# EAGLE design mequencer (EAGLE 6.5.0)
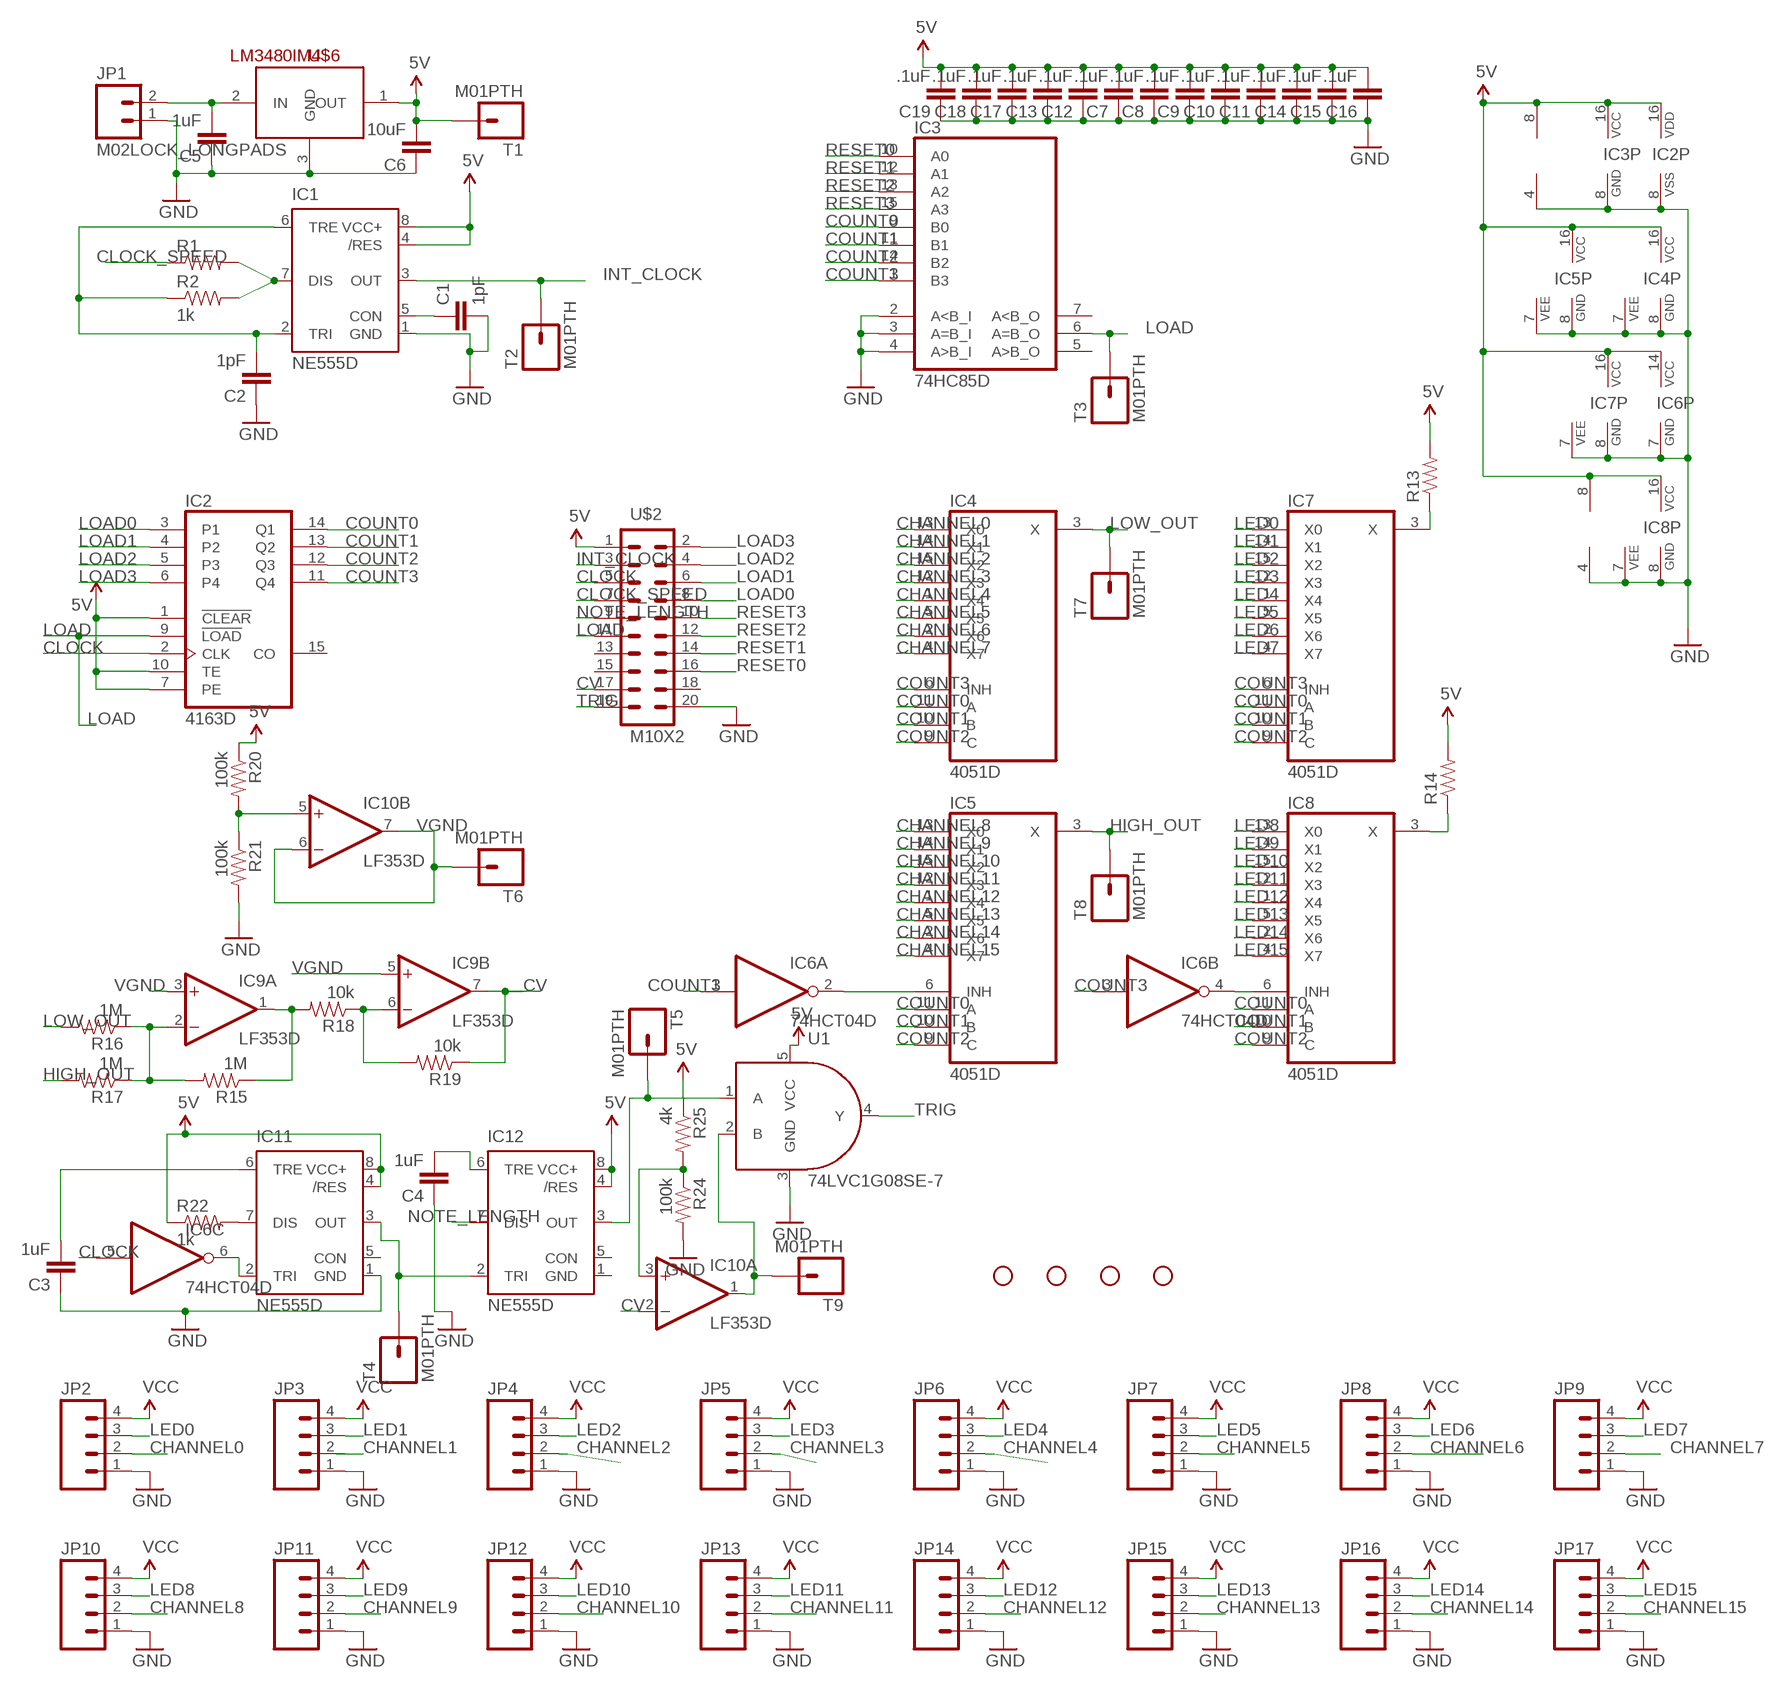
[diagram p0: schematic, sheet 1]

## Parts
C1  1pF  CAP0603-CAP  [0603-CAP]
C2  1pF  CAP0603-CAP  [0603-CAP]
C3  1uF  CAP0603-CAP  [0603-CAP]
C4  1uF  CAP0603-CAP  [0603-CAP]
C5  1uF  CAP0603-CAP  [0603-CAP]
C6  10uF  CAP0603-CAP  [0603-CAP]
C7  .1uF  CAP0603-CAP  [0603-CAP]
C8  .1uF  CAP0603-CAP  [0603-CAP]
C9  .1uF  CAP0603-CAP  [0603-CAP]
C10  .1uF  CAP0603-CAP  [0603-CAP]
C11  .1uF  CAP0603-CAP  [0603-CAP]
C12  .1uF  CAP0603-CAP  [0603-CAP]
C13  .1uF  CAP0603-CAP  [0603-CAP]
C14  .1uF  CAP0603-CAP  [0603-CAP]
C15  .1uF  CAP0603-CAP  [0603-CAP]
C16  .1uF  CAP0603-CAP  [0603-CAP]
C17  .1uF  CAP0603-CAP  [0603-CAP]
C18  .1uF  CAP0603-CAP  [0603-CAP]
C19  .1uF  CAP0603-CAP  [0603-CAP]
IC1  NE555D  [SO08]
IC2  4163D  [SO16]
IC3  74HC85D  [SO16]
IC4  4051D  [SO16]
IC5  4051D  [SO16]
IC6  74HCT04D  [SO14]
IC7  4051D  [SO16]
IC8  4051D  [SO16]
IC9  LF353D  [SO08]
IC10  LF353D  [SO08]
IC11  NE555D  [SO08]
IC12  NE555D  [SO08]
JP1  M02LOCK_LONGPADS  [1X02_LOCK_LONGPADS]
JP2  M04JST-PTH  [JST-4-PTH]
JP3  M04JST-PTH  [JST-4-PTH]
JP4  M04JST-PTH  [JST-4-PTH]
JP5  M04JST-PTH  [JST-4-PTH]
JP6  M04JST-PTH  [JST-4-PTH]
JP7  M04JST-PTH  [JST-4-PTH]
JP8  M04JST-PTH  [JST-4-PTH]
JP9  M04JST-PTH  [JST-4-PTH]
JP10  M04JST-PTH  [JST-4-PTH]
JP11  M04JST-PTH  [JST-4-PTH]
JP12  M04JST-PTH  [JST-4-PTH]
JP13  M04JST-PTH  [JST-4-PTH]
JP14  M04JST-PTH  [JST-4-PTH]
JP15  M04JST-PTH  [JST-4-PTH]
JP16  M04JST-PTH  [JST-4-PTH]
JP17  M04JST-PTH  [JST-4-PTH]
R1  RESISTOR0603  [0603-RES]
R2  1k  RESISTOR0603  [0603-RES]
R13  RESISTOR0603  [0603-RES]
R14  RESISTOR0603  [0603-RES]
R15  1M  RESISTOR0603  [0603-RES]
R16  1M  RESISTOR0603  [0603-RES]
R17  1M  RESISTOR0603  [0603-RES]
R18  10k  RESISTOR0603  [0603-RES]
R19  10k  RESISTOR0603  [0603-RES]
R20  100k  RESISTOR0603  [0603-RES]
R21  100k  RESISTOR0603  [0603-RES]
R22  1k  RESISTOR0603  [0603-RES]
R24  100k  RESISTOR0603  [0603-RES]
R25  4k  RESISTOR0603  [0603-RES]
STANDOFF1  STAND-OFF  [STAND-OFF]
STANDOFF2  STAND-OFF  [STAND-OFF]
STANDOFF3  STAND-OFF  [STAND-OFF]
STANDOFF4  STAND-OFF  [STAND-OFF]
T1  M01PTH  [1X01]
T2  M01PTH  [1X01]
T3  M01PTH  [1X01]
T4  M01PTH  [1X01]
T5  M01PTH  [1X01]
T6  M01PTH  [1X01]
T7  M01PTH  [1X01]
T8  M01PTH  [1X01]
T9  M01PTH  [1X01]
U1  74LVC1G08SE-7  7408SE  [SOT353]
U$2  M10X2  [2X10]
U$6  LM3480IM4  [SOT23-3]

## Nets
5V: C6.2 C7.2 C8.2 C9.2 C10.2 C11.2 C12.2 C13.2 C14.2 C15.2 C16.2 C17.2 C18.2 C19.2 IC1.4(/RES) IC1.8(VCC+) IC2.1(!CLEAR) IC2.7(PE) IC2.10(TE) IC2.16(VDD) IC3.16(VCC) IC4.16(VCC) IC5.16(VCC) IC6.14(P:VCC) IC7.16(VCC) IC8.16(VCC) IC9.8(P:V+) IC10.8(P:V+) IC11.4(/RES) IC11.8(VCC+) IC12.4(/RES) IC12.8(VCC+) R13.2 R14.2 R20.1 R22.1 R25.1 T1.1 U1.5(VCC) U$2.1 U$6.1(OUT)
CHANNEL0: IC4.13(X0) JP2.2
CHANNEL1: IC4.14(X1)
CHANNEL2: IC4.15(X2) JP4.2
CHANNEL3: IC4.12(X3) JP5.2
CHANNEL4: IC4.1(X4) JP6.2
CHANNEL5: IC4.5(X5) JP7.2
CHANNEL6: IC4.2(X6) JP8.2
CHANNEL7: IC4.4(X7) JP9.2
CHANNEL8: IC5.13(X0) JP10.2
CHANNEL9: IC5.14(X1) JP11.2
CHANNEL10: IC5.15(X2) JP12.2
CHANNEL11: IC5.12(X3) JP13.2
CHANNEL12: IC5.1(X4) JP14.2
CHANNEL13: IC5.5(X5) JP15.2
CHANNEL14: IC5.2(X6) JP16.2
CHANNEL15: IC5.4(X7) JP17.2
CLOCK: IC2.2(CLK) IC6.5(C:I) U$2.5
CLOCK_SPEED: R1.1 U$2.7
COUNT0: IC2.14(Q1) IC3.9(B0) IC4.11(A) IC5.11(A) IC7.11(A) IC8.11(A)
COUNT1: IC2.13(Q2) IC3.11(B1) IC4.10(B) IC5.10(B) IC7.10(B) IC8.10(B)
COUNT2: IC2.12(Q3) IC3.14(B2) IC4.9(C) IC5.9(C) IC7.9(C) IC8.9(C)
COUNT3: IC2.11(Q4) IC3.1(B3) IC4.6(INH) IC6.1(A:I) IC6.3(B:I) IC7.6(INH)
CV: IC9.7(B:OUT) IC10.2(A:-IN) R19.1 U$2.17
GND: C1.2 C2.1 C3.1 C4.1 C5.1 C6.1 C7.1 C8.1 C9.1 C10.1 C11.1 C12.1 C13.1 C14.1 C15.1 C16.1 C17.1 C18.1 C19.1 IC1.1(GND) IC2.8(VSS) IC3.2(A<B_I) IC3.3(A=B_I) IC3.4(A>B_I) IC3.8(GND) IC4.7(VEE) IC4.8(GND) IC5.7(VEE) IC5.8(GND) IC6.7(P:GND) IC7.7(VEE) IC7.8(GND) IC8.7(VEE) IC8.8(GND) IC9.4(P:V-) IC10.4(P:V-) IC11.1(GND) JP1.1 JP2.1 JP3.1 JP4.1 JP5.1 JP6.1 JP7.1 JP8.1 JP9.1 JP10.1 JP11.1 JP12.1 JP13.1 JP14.1 JP15.1 JP16.1 JP17.1 R21.2 R24.2 U1.3(GND) U$2.20 U$6.3(GND)
HIGH_OUT: IC5.3(X) R17.2 T8.1
INT_CLOCK: IC1.3(OUT) T2.1 U$2.3
LED0: IC7.13(X0) JP2.3
LED1: IC7.14(X1) JP3.3
LED2: IC7.15(X2) JP4.3
LED3: IC7.12(X3) JP5.3
LED4: IC7.1(X4) JP6.3
LED5: IC7.5(X5) JP7.3
LED6: IC7.2(X6) JP8.3
LED7: IC7.4(X7) JP9.3
LED8: IC8.13(X0) JP10.3
LED9: IC8.14(X1) JP11.3
LED10: IC8.15(X2) JP12.3
LED11: IC8.12(X3) JP13.3
LED12: IC8.1(X4) JP14.3
LED13: IC8.5(X5) JP15.3
LED14: IC8.2(X6) JP16.3
LED15: IC8.4(X7) JP17.3
LOAD: IC2.9(!LOAD) IC3.6(A=B_O) T3.1 U$2.11
LOAD0: IC2.3(P1) U$2.8
LOAD1: IC2.4(P2) U$2.6
LOAD2: IC2.5(P3) U$2.4
LOAD3: IC2.6(P4) U$2.2
LOW_OUT: IC4.3(X) R16.2 T7.1
N$2: C1.1 IC1.5(CON)
N$3: IC1.7(DIS) R1.2 R2.2
N$4: C2.2 IC1.2(TRI) IC1.6(TRE) R2.1
N$8: IC5.6(INH) IC6.2(A:O)
N$9: IC6.4(B:O) IC8.6(INH)
N$10: IC7.3(X) R13.1
N$11: IC9.1(A:OUT) R15.1 R18.2
N$12: IC9.2(A:-IN) R15.2 R16.1 R17.1
N$13: IC9.6(B:-IN) R18.1 R19.2
N$15: IC10.5(B:+IN) R20.2 R21.1
N$16: IC11.7(DIS) R22.2
N$18: C3.2 IC11.6(TRE)
N$19: IC8.3(X) R14.1
N$20: IC6.6(C:O) IC11.2(TRI)
N$21: C4.2 IC12.6(TRE)
N$22: IC10.1(A:OUT) T9.1 U1.2(B)
N$23: IC11.3(OUT) IC12.2(TRI) T4.1
N$24: IC10.3(A:+IN) R24.1 R25.2
N$25: IC12.3(OUT) T5.1 U1.1(A)
N$27: C5.2 JP1.2 U$6.2(IN)
NOTE_LENGTH: IC12.7(DIS) U$2.9
RESET0: IC3.10(A0) U$2.16
RESET1: IC3.12(A1) U$2.14
RESET2: IC3.13(A2) U$2.12
RESET3: IC3.15(A3) U$2.10
TRIG: U1.4(Y) U$2.19
VCC: JP2.4 JP3.4 JP4.4 JP5.4 JP6.4 JP7.4 JP8.4 JP9.4 JP10.4 JP11.4 JP12.4 JP13.4 JP14.4 JP15.4 JP16.4 JP17.4
VGND: IC9.3(A:+IN) IC9.5(B:+IN) IC10.6(B:-IN) IC10.7(B:OUT) T6.1
Unconnected: IC2.15(CO) IC3.5(A>B_O) IC3.7(A<B_O) IC6.8(D:O) IC6.9(D:I) IC6.10(E:O) IC6.11(E:I) IC6.12(F:O) IC6.13(F:I) IC11.5(CON) IC12.5(CON) JP3.2 U$2.13 U$2.15 U$2.18

## Power pins joined to a net without a drawn wire
GND: IC12.1(GND)

## Library data of the parts
C1-C19 = SparkFun-Capacitors:CAP: Capacitor Standard 0603 ceramic capacitor, and 0.1" leaded capacitor.
IC1 IC11 IC12 = SparkFun-AnalogIC:NE555: General purpose bipolar Timer
IC2 = 40xx:4163: Synchronous presettable 4-bit binary COUNTER
IC3 = 74xx-eu:74*85: 4-bit magnitude COMPARATOR
IC4 IC5 IC7 IC8 = 40xx:4051: 8-channel ANALOG MULTIPLEXER
IC6 = 74xx-eu:74*04: Hex INVERTER
IC9 IC10 = linear:LF353: OP AMP
JP1 = SparkFun-Connectors:M02: Standard 2-pin 0.1" header. Use with - straight break away headers ( PRT-00116) - right angle break away headers (PRT-00553) - swiss pins (PRT-00743) - machine pins (PRT-00117) - female headers (PRT-00115) Molex polarized connector foot print use with: PRT-08233 with associated crimp pins and housings. 2.54_SCREWTERM for use with PRT-10571. 3.5mm Screw Terminal footprints for PRT-08084 5mm Screw Terminal footprints for use with PRT-08433
JP2-JP17 = SparkFun-Connectors:M04: Header 4 Standard 4-pin 0.1" header. Use with straight break away headers (SKU : PRT-00116), right angle break away headers (PRT-00553), swiss pins (PRT-00743), machine pins (PRT-00117), and female headers (PRT-00115). Molex polarized connector foot print use with SKU : PRT-08231 with associated crimp pins and housings. 1MM SMD Version SKU: PRT-10208
R1 R2 R13-R22 R24 R25 = SparkFun-Resistors:RESISTOR: Resistor Basic schematic elements and footprints for 0603, 1206, and PTH resistors.
STANDOFF1-STANDOFF4 = SparkFun-Electromechanical:STAND-OFF: #4 Stand Off This is the mechanical footprint for a #4 phillips button head screw. Use the keepout ring to avoid running the screw head into surrounding components. SKU : PRT-00447
T1-T9 = SparkFun-Connectors:M01: Header 1 Standard 1-pin 0.1" header. Use with straight break away headers (SKU : PRT-00116), right angle break away headers (PRT-00553), swiss pins (PRT-00743), machine pins (PRT-00117), and female headers (PRT-00115).
U1 = SparkFun-DigitalIC:74*08: Single 2-input AND gate 74LVC1G08SE-7 IC-10841; PROD_ID: IC-10841
U$2 = SparkFun-Connectors:M10X2: This was SPECIALLY designed to be used with our Graphic LCD Backpack. Be sure you want to use this! It is not only staggered on each line of header holes, but IT IS ALSO offset of the center point of the top and bottom lines by 5 mil. This causes the headers to lock into place on the "standard" footprint on the LCD screen. The extra squares on the tdocu layer are there simply to reference other pins (if you were to actually populate a longer header than ten long - this is what we do with the backpacks).
U$6 = SparkFun-PowerIC:LM3480IM4: Small package linear regulator

## Board
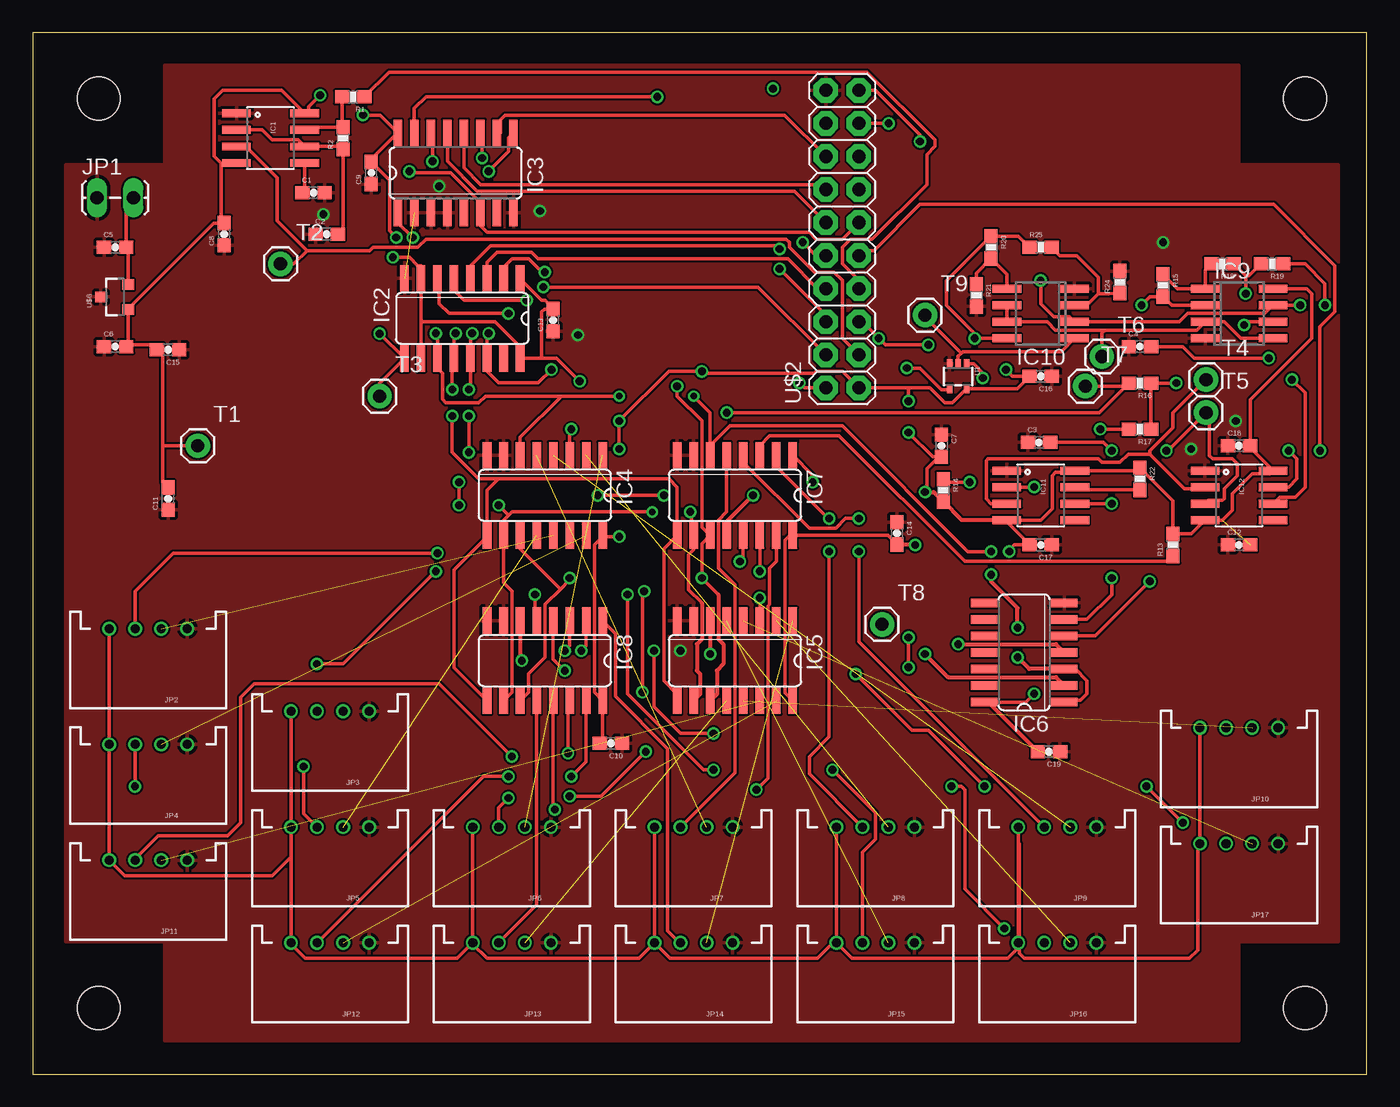
[diagram p1: board, top side]
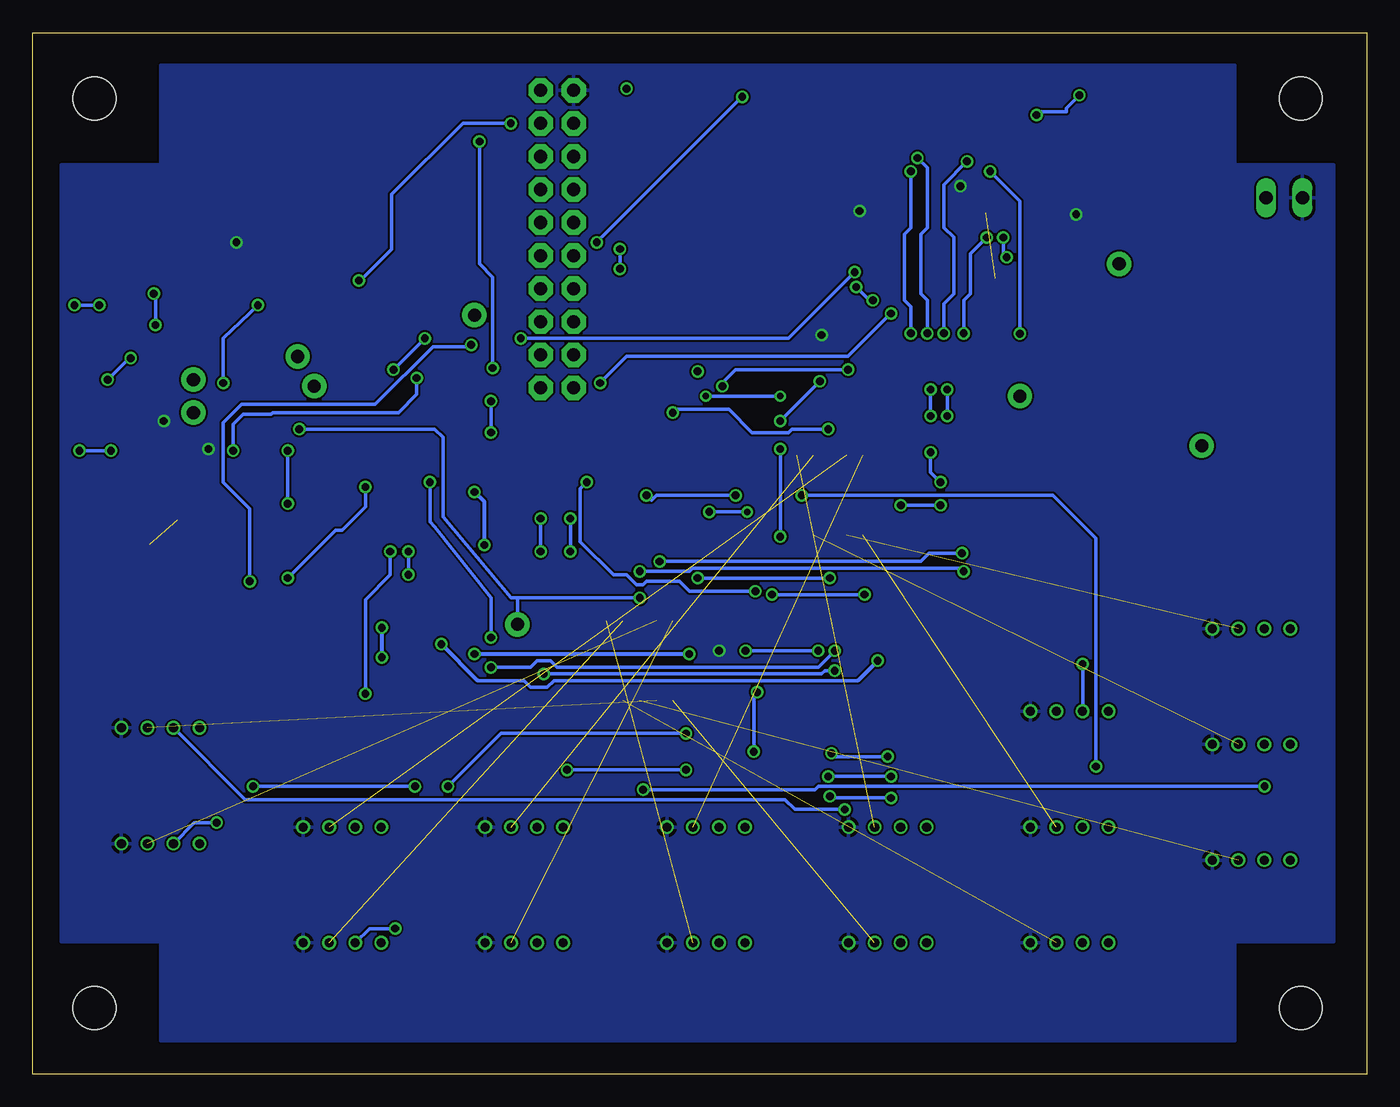
[diagram p2: board, bottom side, seen from below]

Size 102.54 x 80 mm. Coordinates in mm from the lower left corner, seen from the top.
Outline: 0,0 102.54,0 102.54,80 0,80 0,0
Copper layers (1*16): Top 0.0356mm / dielectric 1.5011mm / Bottom 0.0356mm
Design rules "LaenPCBOrder *": minimum track width 6mil, minimum drill 13mil, track to track 6mil, track to pad 6mil, pad to pad 6mil, via to via 6mil, smd to smd 6mil, copper to edge 15mil, drill to drill 6mil, minimum pad ring 7mil, minimum via ring 7mil, stop-mask expansion 3mil, vias tented up to drill 25mil, thermal gap 10mil

### Footprints (pad centres in the part's own frame; a part is rotated, then mirrored left to right if it is on the bottom)
0603-CAP = smd 1.1 x 1: 1 -0.85,0; 2 0.85,0
SO08 = smd 0.61 x 2.21: 1 -1.905,-2.616; 2 -0.635,-2.616; 3 0.635,-2.616; 4 1.905,-2.616; 5 1.905,2.616; 6 0.635,2.616; 7 -0.635,2.616; 8 -1.905,2.616
SO16 = smd 0.66 x 2.032: 1 -4.445,-3.073; 2 -3.175,-3.073; 3 -1.905,-3.073; 4 -0.635,-3.073; 5 0.635,-3.073; 6 1.905,-3.073; 7 3.175,-3.073; 8 4.445,-3.073; 9 4.445,3.073; 10 3.175,3.073; 11 1.905,3.073; 12 0.635,3.073; 13 -0.635,3.073; 14 -1.905,3.073; 15 -3.175,3.073; 16 -4.445,3.073
SO14 = smd 0.66 x 2.032: 1 -3.81,-3.073; 2 -2.54,-3.073; 3 -1.27,-3.073; 4 0,-3.073; 5 1.27,-3.073; 6 2.54,-3.073; 7 3.81,-3.073; 8 3.81,3.073; 9 2.54,3.073; 10 1.27,3.073; 11 0,3.073; 12 -1.27,3.073; 13 -2.54,3.073; 14 -3.81,3.073
SO08' = smd 0.6 x 2.2: 1 -1.905,-2.6; 2 -0.635,-2.6; 3 0.635,-2.6; 4 1.905,-2.6; 5 1.905,2.6; 6 0.635,2.6; 7 -0.635,2.6; 8 -1.905,2.6
1X02_LOCK_LONGPADS = drill 1.016 long: 1 -0.127,0; 2 2.667,0
JST-4-PTH = drill 0.7: 1 -3,-5; 2 -1,-5; 3 1,-5; 4 3,-5
0603-RES = smd 1.1 x 1: 1 -0.85,0; 2 0.85,0
STAND-OFF = hole 3.302: 0,0
1X01 = drill 1.016 pad 1.88: 1 0,0
SOT353 = smd 0.42 x 0.7: 1 -0.65,-0.95; 2 0,-0.95; 3 0.65,-0.95; 4 0.65,0.95; 5 -0.65,0.95
2X10 = drill 1.016 pad 1.88 octagon: 1 -11.43,-1.27; 2 -11.43,1.27; 3 -8.89,-1.27; 4 -8.89,1.27; 5 -6.35,-1.27; 6 -6.35,1.27; 7 -3.81,-1.27; 8 -3.81,1.27; 9 -1.27,-1.27; 10 -1.27,1.27; 11 1.27,-1.27; 12 1.27,1.27; 13 3.81,-1.27; 14 3.81,1.27; 15 6.35,-1.27; 16 6.35,1.27; 17 8.89,-1.27; 18 8.89,1.27; 19 11.43,-1.27; 20 11.43,1.27
SOT23-3 = smd 0.8 x 0.9: 1 -0.95,-1; 2 0.95,-1; 3 0,1.1

### Placement (x,y rotation side)
C1  21.59,67.69 0 top
C2  22.61,64.52 0 top
C3  77.34,48.51 0 top
C4  85.09,55.88 0 top
C5  6.35,63.5 0 top
C6  6.35,55.88 0 top
C7  69.85,48.26 270 top
C8  14.73,64.52 90 top
C9  26.04,69.22 90 top
C10  44.45,25.4 180 top
C11  10.41,44.2 90 top
C12  92.71,40.64 0 top
C13  40.01,57.91 90 top
C14  66.42,41.53 270 top
C15  10.41,55.63 180 top
C16  77.47,53.59 180 top
C17  77.47,40.64 180 top
C18  92.71,48.26 0 top
C19  78.11,24.77 180 top
IC1  18.29,71.88 270 top
IC2  33.02,58.04 180 top
IC3  32.51,69.22 0 top
IC4  39.37,44.45 180 top
IC5  53.98,31.75 180 top
IC6  76.2,32.38 90 top
IC7  53.98,44.45 180 top
IC8  39.37,31.75 180 top
IC9  LF353D  [SO08']  92.71,58.42 270 top
IC10  LF353D  [SO08']  77.47,58.42 90 top
IC11  77.47,44.45 270 top
IC12  92.71,44.45 270 top
JP1  5.08,67.31 0 top
JP2  8.89,29.21 180 top
JP3  22.86,22.86 180 top
JP4  8.89,20.32 180 top
JP5  22.86,13.97 180 top
JP6  36.83,13.97 180 top
JP7  50.8,13.97 180 top
JP8  64.77,13.97 180 top
JP9  78.74,13.97 180 top
JP10  92.71,21.59 180 top
JP11  8.89,11.43 180 top
JP12  22.86,5.08 180 top
JP13  36.83,5.08 180 top
JP14  50.8,5.08 180 top
JP15  64.77,5.08 180 top
JP16  78.74,5.08 180 top
JP17  92.71,12.7 180 top
R1  24.64,75.06 180 top
R2  23.88,71.88 90 top
R13  87.63,40.64 90 top
R14  69.98,44.83 270 top
R15  86.87,60.58 270 top
R16  85.09,53.07 180 top
R17  85.09,49.53 180 top
R18  91.44,62.23 180 top
R19  95.25,62.23 180 top
R20  73.66,63.5 270 top
R21  72.52,59.82 270 top
R22  85.09,45.72 270 top
R24  83.57,60.83 90 top
R25  77.47,63.5 0 top
STANDOFF1  97.79,74.93 0 top
STANDOFF2  5.08,74.93 0 top
STANDOFF3  5.08,5.08 0 top
STANDOFF4  97.79,5.08 0 top
T1  12.7,48.26 0 top
T2  19.05,62.23 0 top
T3  26.67,52.07 0 top
T4  90.17,53.34 0 top
T5  90.17,50.8 0 top
T6  82.17,55.12 0 top
T7  80.9,52.83 0 top
T8  65.28,34.54 0 top
T9  68.58,58.29 0 top
U1  71.12,53.59 180 top
U$2  62.23,64.14 90 top
U$6  6.35,59.69 90 top

### Tracks (layer width: path | path; a pad name or v marks a point on that pad's centre or on a via)
5V  (via drill 0.6)  (1 unrouted)
  Top 0.254: IC1.4 14.48,69.98 | 14.48,69.98 13.97,70.48 13.97,74.93 14.61,75.56 19.13,75.56 IC1.8 21.21,73.79 21.21,74.3 v22.1,75.18 | 14.48,69.98 14.48,65.62 C8.2 13.93,65.37 7.35,58.78 U$6.1 7.35,56.03 | 7.35,56.03 C6.2 | 7.35,56.03 9.16,56.03 C15.2 10.01,55.63 10.01,48.39 | 10.01,48.39 10.01,45.45 C11.2 | C10.2 43.82,25.61 IC8.16 43.18,29.31 43.18,40.64 43.82,41.27 IC4.16 43.92,41.27 v45.09,41.27 | v45.09,48.01 v45.09,50.16 48.9,53.98 v51.44,53.98 51.56,53.85 60.07,53.85 60.2,53.98 62.23,53.98 U$2.1 67.31,52.7 | C14.2 65.72,41.38 IC7.16 58.19,41.38 57.81,41 57.81,29.29 IC5.16 | 67.31,52.7 68.96,52.7 70.1,51.56 70.69,51.56 U1.5 75.67,52.64 C16.2 75.31,53.59 v74.8,54.1 | v25.4,73.66 26.7,73.66 IC3.16 26.04,70.26 C9.2 27.43,68.67 27.43,64.77 v27.94,64.26 | v27.69,62.74 28.96,62.74 29.59,62.1 29.84,62.1 IC2.7 29.84,57.78 | v42.04,53.21 40.28,54.97 39.12,54.97 | 39.12,54.97 IC2.16 37.47,55.88 35.56,57.78 29.84,57.78 | 29.84,57.78 IC2.10 | IC2.1 37.47,61.09 39.12,59.44 39.37,59.44 39.66,59.14 C13.2 39.33,58.76 39.12,58.55 39.12,54.97 | R25.1 75.77,64.35 R20.1 70.23,60.92 70.23,59.05 72.77,56.52 IC10.8 v72.39,56.52 | IC9.8 97.92,60.33 98.3,59.94 98.3,56.52 93.56,51.78 C18.2 93.56,48.12 IC12.8 95.07,46.1 93.73,46.1 92.2,44.58 92.2,43.31 91.44,42.55 IC12.4 89.04,41.49 R13.2 87.63,44.03 R22.1 84.88,46.35 IC11.8 79.96,46.23 78.61,46.23 78.36,45.97 78.36,43.43 77.47,42.55 IC11.4 74.85,42.41 C17.2 75.44,40.64 75.06,40.26 v75.06,40.13 | 73.45,28.57 76.33,28.57 v76.96,29.21 | v68.58,44.7 68.71,44.83 68.71,46.48 69.64,47.41 C7.2 69.18,47.41 v67.31,49.28 | v67.31,51.69 67.31,52.7
  Top 0.254: T1.1 10.13,48.26 10.01,48.39
  Top 0.305: IC6.14 73.45,28.57 C19.2 | IC11.4 71.41,42.55 R14.2 69.25,44.7 v68.58,44.7 | C14.2 67.78,40.68 v67.82,40.64
  Bottom 0.254: v45.09,48.01 v45.09,41.27 | v45.09,50.16 v42.04,53.21 | v25.4,73.66 25.15,73.91 23.11,73.91 23.11,74.17 v22.1,75.18 | v27.94,64.26 27.94,62.99 v27.69,62.74 | v76.96,29.21 76.96,36.45 75.06,38.35 v75.06,40.13 | v67.31,49.28 v67.31,51.69 | v74.8,54.1 v72.39,56.52
  Bottom 0.305: v67.82,40.64 67.82,43.94 v68.58,44.7
CHANNEL0  (1 unrouted)
CHANNEL2  (1 unrouted)
CHANNEL3  (1 unrouted)
CHANNEL4  (1 unrouted)
CHANNEL5  (1 unrouted)
CHANNEL6  (1 unrouted)
CHANNEL7  (1 unrouted)
CHANNEL8  (1 unrouted)
CHANNEL9  (1 unrouted)
CHANNEL10  (1 unrouted)
CHANNEL11  (1 unrouted)
CHANNEL12  (1 unrouted)
CHANNEL13  (1 unrouted)
CHANNEL14  (1 unrouted)
CHANNEL15  (1 unrouted)
CLOCK  (via drill 0.6)
  Top 0.254: 36.32,61.24 IC2.2 36.2,61.98 36.83,62.61 38.1,62.61 38.99,61.72 38.99,61.59 v39.37,61.59 | U$2.5 63.75,57.78 v65.02,56.52 65.53,56.01 v68.83,56.01 | IC6.5 81.66,33.66 v85.85,37.85
  Bottom 0.254: v65.02,56.52 44.45,56.52 v39.37,61.59 | v85.85,37.85 85.85,43.43 87.88,45.47 87.88,50.04 86.49,51.44 76.2,51.44 71.75,55.88 68.96,55.88 v68.83,56.01
CLOCK_SPEED
  Top 0.254: U$2.7 63.5,60.96 62.23,62.23 62.23,63.5 62.87,64.14 64.52,64.14 68.71,68.33 68.71,70.61 69.34,71.25 69.34,71.75 64.14,76.96 27.39,76.96 R1.1
COUNT0  (via drill 0.6)
  Top 0.254: 52.71,36.83 v51.44,38.1 51.44,40.74 IC7.11 51.44,42.01 51.44,50.16 49.53,52.07 v49.53,52.83 | IC8.11 38.1,29.31 38.1,30.73 39.37,32 39.37,36.07 40.56,37.25 | v41.28,38.1 41.28,37.97 40.56,37.25 | IC4.11 37.47,40.34 40.56,37.25 | v39.88,54.1 38.86,53.09 35.81,53.09 34.92,53.98 IC2.14 34.92,56.77 v35.05,56.9 | v35.05,69.34 36.58,70.87 36.58,71.91 IC3.9
  Top 0.305: 52.71,36.83 52.71,33.4 53.09,33.02 53.09,31.5 52.58,30.99 52.58,29.18 IC5.11
  Bottom 0.254: v41.28,38.1 v51.44,38.1 | v39.88,54.1 48.51,54.1 49.53,53.09 v49.53,52.83 | v35.05,56.9 35.05,58.93 35.56,59.44 35.56,64.52 35.05,65.02 v35.05,69.34
COUNT1  (via drill 0.51 pad 0.3, 0.6)
  Top 0.254: v47.62,43.18 36.83,43.18 36.58,42.93 | 36.58,42.93 36.2,42.55 IC4.10 36.2,37.72 36.83,37.08 36.83,29.31 IC8.10 | 51.44,36.2 50.42,37.21 50.42,39.88 50.8,40.26 IC7.10 v50.55,43.18 | v33.53,52.58 33.66,52.7 IC2.13 33.66,56.77 v33.78,56.9 | v33.53,50.55 v33.53,47.75 | v32.77,45.47 v32.77,43.69 | v35.81,43.69 36.58,42.93 | v34.54,70.36 34.54,72.16 IC3.11
  Top 0.305: 51.44,36.2 51.44,33.4 51.05,33.02 51.05,30.99 51.31,30.73 51.31,29.18 IC5.10
  Bottom 0.254: v50.55,43.18 v47.62,43.18 | v33.53,52.58 v33.53,50.55 | v33.53,47.75 33.53,46.23 v32.77,45.47 | v32.77,43.69 v35.81,43.69 | v33.78,56.9 33.78,59.44 34.29,59.94 34.29,64.52 33.78,65.02 33.78,69.6 v34.54,70.36
COUNT2  (via drill 0.6)
  Top 0.254: 35.81,45.72 48.9,45.72 49.53,45.09 IC7.9 | IC7.9 49.53,41.27 | IC8.9 32.38,31.22 32.38,38.73 34.92,41.27 IC4.9 34.92,44.83 35.81,45.72 | IC5.9 49.53,29.18 48.51,30.2 48.51,40.36 IC7.9 | 35.81,45.72 34.29,45.72 32.26,47.75 v32.26,50.55 | v32.26,52.58 32.26,54.84 IC2.12 32.38,56.77 v32.51,56.9 | v30.73,70.1 30.73,72.16 IC3.14
  Bottom 0.254: v32.26,50.55 v32.26,52.58 | v32.51,56.9 32.51,59.18 31.75,59.94 31.75,64.26 32.51,65.02 32.51,68.33 v30.73,70.1
COUNT3  (via drill 0.51 pad 0.3, 0.6)
  Top 0.254: v50.8,52.07 52.07,50.8 IC7.6 52.07,48.26 53.59,49.78 62.23,49.78 71.88,40.13 v73.66,40.13 | IC4.6 37.47,48.9 40.64,52.07 | 40.64,52.07 v45.09,52.07 | IC6.3 80.14,31.11 81.03,30.23 81.03,29.21 80.52,28.7 79.4,28.7 IC6.1 | v73.66,38.35 73.66,37.85 | 40.64,52.07 34.8,52.07 34.29,51.56 31.75,51.56 31.5,51.82 31.5,53.85 31.24,54.1 31.24,54.84 IC2.11 31.11,56.77 v30.99,56.9 | IC3.1 28.07,65.41 v29.21,64.26
  Top 0.305: IC6.3 76.58,31.11 v75.69,32 | v75.69,34.29 75.69,35.81 73.66,37.85
  Bottom 0.254: v45.09,52.07 v50.8,52.07 | v73.66,40.13 v73.66,38.35 | v30.99,56.9 30.99,59.44 30.48,59.94 30.48,62.99 29.46,64.01 29.46,64.26 v29.21,64.26
  Bottom 0.305: v75.69,32 v75.69,34.29
CV  (via drill 0.6)
  Top 0.254: U$2.17 v65.79,73.03 | v77.47,60.96 77.47,59.18 78.49,58.17 79.69,58.17 IC10.2 88.14,57.78 88.77,58.42 94.67,58.42 IC9.7 v97.41,59.05 | R19.1 97.79,62.23 99.31,60.71 v99.31,59.05
  Bottom 0.254: v65.79,73.03 69.47,73.03 74.93,67.56 74.93,63.37 77.34,60.96 v77.47,60.96 | v99.31,59.05 v97.41,59.05
GND  (via drill 0.6)  (1 unrouted)
  other vias: 49.78,32.51 22.35,66.04 41.91,56.77 31.24,68.2 86.87,63.88 92.46,50.16 89.03,48.01 38.99,66.29
  pour Bottom: 2.54,69.85 10.16,69.85 10.16,77.47 92.71,77.47 92.71,69.85 100.33,69.85 100.33,10.16 92.71,10.16 92.71,2.54 10.16,2.54 10.16,10.16 2.54,10.16
  pour Top: 2.54,69.85 2.54,10.16 10.16,10.16 10.16,2.54 92.71,2.54 92.71,10.16 100.33,10.16 100.33,69.85 92.71,69.85 92.71,77.47 10.16,77.47 10.16,69.85
HIGH_OUT  (via drill 0.6)
  Top 0.254: IC5.3 v55.88,36.58 | v82.04,49.53 R17.2
  Bottom 0.254: v55.88,36.58 65.28,36.58 | 65.28,36.58 65.79,36.58 70.99,42.8 70.99,48.9 71.63,49.53 v82.04,49.53 | T8.1 65.28,36.58
INT_CLOCK
  Top 0.254: IC1.3 16.38,71.25 18.8,68.83 18.8,65.53 21.08,63.25 | 21.08,63.25 25.91,63.25 26.16,63.5 29.59,63.5 30.23,64.14 57.91,64.14 58.17,63.88 58.17,63.5 60.07,61.59 61.59,61.59 62.23,60.96 62.23,56.52 U$2.3 | T2.1 20.07,62.23 21.08,63.25
LED0  (via drill 0.6)
  Top 0.254: JP2.3 7.89,37.1 10.79,40.01 v31.11,40.01 | IC7.13 54.61,39.62 v54.36,39.37
  Bottom 0.254: v31.11,40.01 33.66,40.01 34.29,39.37 v54.36,39.37
LED1  (via drill 0.6)
  Top 0.254: IC7.14 v55.88,38.61 | v30.99,38.61 23.88,31.5 v21.84,31.5
  Bottom 0.254: v55.88,38.61 52.07,38.61 51.82,38.86 31.24,38.86 v30.99,38.61 | v21.84,31.5 21.84,27.88 JP3.3
LED2  (via drill 0.6)
  Top 0.254: IC7.15 57.15,39.37 56.64,38.86 56.64,36.07 56.52,35.94 56.52,22.73 v55.63,21.84 | JP4.3 7.87,25.3 7.87,22.61 v7.87,22.1
  Bottom 0.254: v55.63,21.84 42.42,21.84 42.16,22.1 v7.87,22.1
LED3  (via drill 0.6)
  Top 0.254: v43.43,44.45 v48.51,44.45 | v20.83,23.62 20.83,20 JP5.3
  Top 0.305: IC7.12 53.34,42.42 v55.37,44.45
  Bottom 0.254: v43.43,44.45 24.13,44.45 20.83,41.15 v20.83,23.62 | v48.51,44.45 54.61,44.45 54.99,44.07 v55.37,44.45
LED4  (via drill 0.6)
  Top 0.254: JP6.3 35.83,20.46 v36.58,21.21 | v41.28,21.34 43.69,21.34 v47.12,24.77 | v59.94,45.47 59.94,46 IC7.1 | v46.86,29.34 46.86,36.96 v46.99,37.08
  Bottom 0.254: v36.58,21.21 41.15,21.21 v41.28,21.34 | v59.94,45.47 60.45,44.96 60.45,40.89 57.91,38.35 56.9,38.35 56.13,37.59 55.63,37.59 55.37,37.85 52.83,37.85 52.07,37.08 v46.99,37.08 | v47.12,24.77 47.12,29.08 v46.86,29.34
LED5
  Top 0.254: IC7.5 53.34,43.18 52.71,42.55 52.71,38.86 53.98,37.59 53.98,23.14 JP7.3
LED6  (via drill 0.6)
  Top 0.254: IC7.2 57.15,46.66 61.14,42.67 v61.21,42.67 | JP8.3 59.69,23.05 59.69,24.38 61.21,25.91 v61.21,40.13
  Bottom 0.254: v61.21,42.67 v61.21,40.13
LED7  (via drill 0.6)
  Top 0.254: IC7.4 54.61,46.99 59.69,41.91 61.72,41.91 62.48,42.67 v63.5,42.67 | v63.5,40.13 63.5,33.21 JP9.3
  Bottom 0.254: v63.5,42.67 v63.5,40.13
LED8  (via drill 0.6)
  Top 0.254: IC8.13 40.01,20.45 v40.13,20.32
  Bottom 0.254: v40.13,20.32 43.94,20.32 44.7,21.08 86.2,21.08 JP10.3
LED9  (via drill 0.6)
  Top 0.254: JP11.3 7.89,16.53 9.65,18.29 14.99,18.29 16,19.3 16,28.96 17.02,29.97 31.24,29.97 v36.83,24.38 | v41.15,24.64 41.15,28.55 IC8.14
  Bottom 0.254: v36.83,24.38 40.89,24.38 v41.15,24.64
LED10  (via drill 0.6)
  Top 0.254: IC8.15 42.55,24 v41.4,22.86 | v36.58,22.86 34.64,22.86 JP12.3
  Bottom 0.254: v41.4,22.86 v36.58,22.86
LED11
  Top 0.254: IC8.12 38.73,12.98 JP13.3
LED12
  Top 0.254: JP14.3 49.73,10.08 48.81,11 48.81,25 44.81,29 44.81,33.83 IC8.1
LED13  (via drill 0.6)
  Top 0.254: JP15.3 63.77,17.03 64.77,18.03 64.77,20.07 v61.47,23.37 | v52.32,23.37 51.56,23.37 45.72,29.21 v45.72,36.83 | v38.61,36.83 38.61,34.95 IC8.5
  Bottom 0.254: v61.47,23.37 v52.32,23.37 | v45.72,36.83 v38.61,36.83
LED14  (via drill 0.6)
  Top 0.254: IC8.2 42.55,32.89 v42.16,32.51 | v47.75,32.51 47.75,28.19 49.78,26.16 v52.32,26.16 | v70.61,22.1 71.37,22.1 71.63,21.84 71.63,14.22 v74.68,11.18
  Bottom 0.254: v42.16,32.51 v47.75,32.51 | v52.32,26.16 66.55,26.16 v70.61,22.1 | v74.68,11.18 76.64,11.18 JP16.3
LED15  (via drill 0.6)
  Top 0.254: IC8.4 40.01,31.88 v40.89,30.99 | v63.25,30.73 67.56,26.42 68.83,26.42 v73.15,22.1 | v85.6,22.1 v88.39,19.3
  Bottom 0.254: v40.89,30.99 41.66,30.99 41.91,30.73 v63.25,30.73 | v73.15,22.1 v85.6,22.1 | v88.39,19.3 90.11,19.3 JP17.3
LOAD  (via drill 0.6)
  Top 0.254: v26.67,56.87 IC2.9 26.67,53.06 T3.1 | U$2.11 62.23,64.14 60.2,64.14 59.69,64.64 34.92,64.64 34.42,65.15 IC3.6 34.42,66.93 32.13,69.22 29.08,69.22 v28.96,69.34
  Bottom 0.254: v26.67,56.87 26.67,67.06 v28.96,69.34
LOAD0
  Top 0.254: IC2.3 34.92,62.36 35.69,63.12 38.35,63.12 38.86,62.61 58.04,62.61 60.33,60.33 U$2.8
LOAD1  (via drill 0.6)
  Top 0.254: IC2.4 33.66,62.1 35.18,63.63 57.15,63.63 v57.4,63.37 | U$2.6 60.96,58.29 v57.4,61.85
  Bottom 0.254: v57.4,63.37 v57.4,61.85
LOAD2  (via drill 0.6)
  Top 0.254: IC2.5 32.38,60.2 33.15,59.44 v37.97,59.44 | v39.24,60.45 55.75,60.45 U$2.4
  Bottom 0.254: v37.97,59.44 38.23,59.44 v39.24,60.45
LOAD3  (via drill 0.6)
  Top 0.254: U$2.2 59.31,52.7 v58.93,53.09 | v36.58,58.42 32,58.42 31.24,59.18 31.24,60.98 IC2.6
  Bottom 0.254: v58.93,53.09 56.9,55.12 39.88,55.12 v36.58,58.42
LOW_OUT  (via drill 0.6)
  Top 0.254: IC4.3 41.28,49.4 v41.4,49.53 | 83.85,52.68 81.97,50.8 v53.34,50.8 | 83.85,52.68 R16.2 | T7.1 83.69,52.83 83.85,52.68
  Bottom 0.254: v41.4,49.53 44.2,49.53 44.45,49.28 47.24,49.28 49.02,51.05 53.09,51.05 v53.34,50.8
N$2
  Top 0.254: IC1.5 20.9,67.86 C1.1
N$3
  Top 0.254: R1.2 23.79,72.82 R2.2 21.12,72.73 IC1.7
N$4
  Top 0.254: IC1.2 17.65,72.52 18.41,71.75 20.4,71.75 IC1.6 23.66,71.25 R2.1 23.88,64.94 C2.2
N$5  (via drill 0.6)
  other vias: 56.9,75.69
N$8  (via drill 0.6)
  Top 0.305: IC5.6 v52.07,32.26 | v68.58,32.26 70.36,30.48 78.64,30.48 IC6.2
  Bottom 0.305: v52.07,32.26 v68.58,32.26
N$9  (via drill 0.6)
  Top 0.305: IC8.6 37.47,31.88 v37.59,31.75 | v71.12,33.02 78.64,33.02 IC6.4
  Bottom 0.254: 39.12,30.23 62.48,30.23 62.99,29.72 64.26,29.72 64.77,30.23 68.33,30.23
  Bottom 0.305: v37.59,31.75 39.12,30.23 | 68.33,30.23 v71.12,33.02
N$10
  Top 0.254: IC7.3 55.88,48.26 56.64,49.02 61.98,49.02 71.63,39.37 87.21,39.37 R13.1
N$11
  Top 0.254: R15.1 87.97,60.33 IC9.1 90.11,61.75 R18.2
N$12  (via drill 0.6)
  Top 0.254: IC9.2 87.54,59.05 R15.2 86.83,59.69 85.85,59.69 v85.22,59.05 | v87.88,53.09 87.87,53.07 R16.1 R17.1
  Bottom 0.254: v87.88,53.09 87.88,56.52 v85.22,59.05
N$13  (via drill 0.6)
  Top 0.254: IC9.6 93.34,57.78 v93.09,57.53 | v93.22,59.94 93.22,61.3 | 93.22,61.3 R18.1 | 93.22,61.3 93.47,61.3 R19.2
  Bottom 0.254: v93.09,57.53 93.09,59.82 v93.22,59.94
N$15
  Top 0.254: IC10.5 74.87,61.44 R20.2 72.52,61.51 R21.1
N$16
  Top 0.254: R22.2 80.3,44.87 IC11.7
N$18  (via drill 0.6)
  Top 0.254: IC11.6 v82.93,43.81 | C3.2 82.3,48.51 v82.93,47.88
  Bottom 0.254: v82.93,43.81 v82.93,47.88
N$19  (via drill 0.6)
  Top 0.254: v67.31,31.24 v67.31,33.53 | v72.01,45.47 70.19,45.47 R14.1 | IC8.3 41.28,32.89 v40.89,32.51
  Bottom 0.254: v67.31,33.53 67.31,36.58 71.63,42.04 72.01,42.42 v72.01,45.47 | v67.31,31.24 64.26,31.24 63.75,31.75 62.74,31.75 62.23,31.24 42.16,31.24 v40.89,32.51
N$20  (via drill 0.6)
  Top 0.254: IC11.2 v76.96,45.09 | v82.93,38.1 82.93,36.83 81.03,34.92 IC6.6
  Bottom 0.254: v76.96,45.09 76.96,43.56 78.74,41.78 79.25,41.78 v82.93,38.1
N$21  (via drill 0.6)
  Top 0.254: C4.2 88.39,55.88 89.28,54.99 v95,54.99 | v96.77,53.34 97.79,52.32 97.79,45.09 97.03,44.32 95.83,44.32 IC12.6
  Bottom 0.254: v95,54.99 95.12,54.99 v96.77,53.34
N$22
  Top 0.254: U1.2 71.12,55.12 71.37,55.37 | 71.37,55.37 71.5,55.5 79.05,55.5 IC10.1 | T9.1 68.58,58.17 71.37,55.37
N$23
  Top 0.254: 85.85,47.62 84.2,47.62 83.57,46.99 82.17,46.99 81.92,47.24 73.41,47.24 73.28,47.12 73.28,44.2 73.66,43.81 IC11.3 | 85.85,47.62 88.52,44.96 89.97,44.96 IC12.2 | 85.85,47.62 85.85,47.88 87.63,49.66 87.63,50.8 T4.1
N$24
  Top 0.254: IC10.3 81.03,59.05 81.92,59.94 | 81.92,59.94 81.92,61.21 80.26,62.87 78.95,62.87 R25.2 | 81.92,59.94 82.72,59.94 R24.1
N$25  (via drill 0.6)
  Top 0.254: U1.1 72.33,54.54 73.03,53.85 v73.03,53.47 | v87.12,47.88 87.25,47.88 T5.1 90.42,50.55 90.42,47.5 90.68,47.24 92.2,47.24 92.58,46.86 92.58,45.97 91.57,44.96 91.57,44.2 91.44,44.07 90.35,44.07 IC12.3
  Bottom 0.254: v73.03,53.47 73.03,52.2 74.42,50.8 84.07,50.8 84.2,50.67 86.36,50.67 87.12,49.91 v87.12,47.88
N$27
  Top 0.254: U$6.2 7.35,63.35 C5.2 7.2,66.76 JP1.2
NOTE_LENGTH  (via drill 0.6)
  Top 0.254: IC12.7 96.52,45.09 97.16,45.72 97.16,47.24 v96.52,47.88 | v98.93,47.88 98.93,57.4 100.08,58.55 100.08,62.1 95.38,66.8 68.2,66.8 64.64,63.25 63.88,63.25 U$2.9
  Bottom 0.254: v96.52,47.88 v98.93,47.88
RESET0
  Top 0.254: IC3.10 35.97,72.29 35.97,73.3 36.32,73.66 57.79,73.66 U$2.16
RESET1
  Top 0.254: 60.71,68.2 U$2.14 60.58,68.33 34.42,68.33 33.15,69.6 IC3.12
RESET2
  Top 0.254: IC3.13 31.88,70.1 34.16,67.82 58.55,67.82 58.67,67.69 U$2.12
RESET3  (via drill 0.6)
  Top 0.254: U$2.10 60.2,62.87 v59.18,63.88 | v48.01,75.06 30.23,75.06 29.34,74.17 IC3.15
  Bottom 0.254: v59.18,63.88 v48.01,75.06
TRIG  (via drill 0.6)
  Top 0.254: U$2.19 64.77,75.56 68.2,72.14 v68.2,71.63 | v67.18,54.23 68.2,54.23 69.85,52.58 70.4,52.58 U1.4
  Bottom 0.254: v68.2,71.63 68.2,62.23 67.18,61.21 v67.18,54.23
VCC
  Top 0.254: JP2.4 JP4.4 JP11.4 7.08,15.24 18.41,15.24 19.86,16.68 JP3.4 JP5.4 JP12.4 19.86,9.98 20.95,8.89 32.64,8.89 JP13.4 JP6.4 33.83,9.98 34.92,8.89 46.61,8.89 JP14.4 | 75.74,17.78 JP16.4 75.74,9.7 74.93,8.89 62.96,8.89 JP15.4 JP8.4 61.77,10.34 60.33,8.89 48.99,8.89 JP14.4 | 75.74,17.78 JP9.4 | 75.74,17.78 75.82,17.7 75.82,9.27 76.2,8.89 88.9,8.89 89.53,9.53 89.53,17.52 JP17.4 JP10.4 | JP7.4 JP14.4
VGND
  Top 0.254: IC10.6 IC10.7 77.98,57.78 78.61,57.15 82.42,57.15 | 82.42,57.15 89.48,57.15 IC9.3 91.57,57.78 92.84,56.52 IC9.5 | T6.1 82.17,56.9 82.42,57.15